# Altium schematic sheet arduino_uno.SchDoc
size 420 x 297 mm
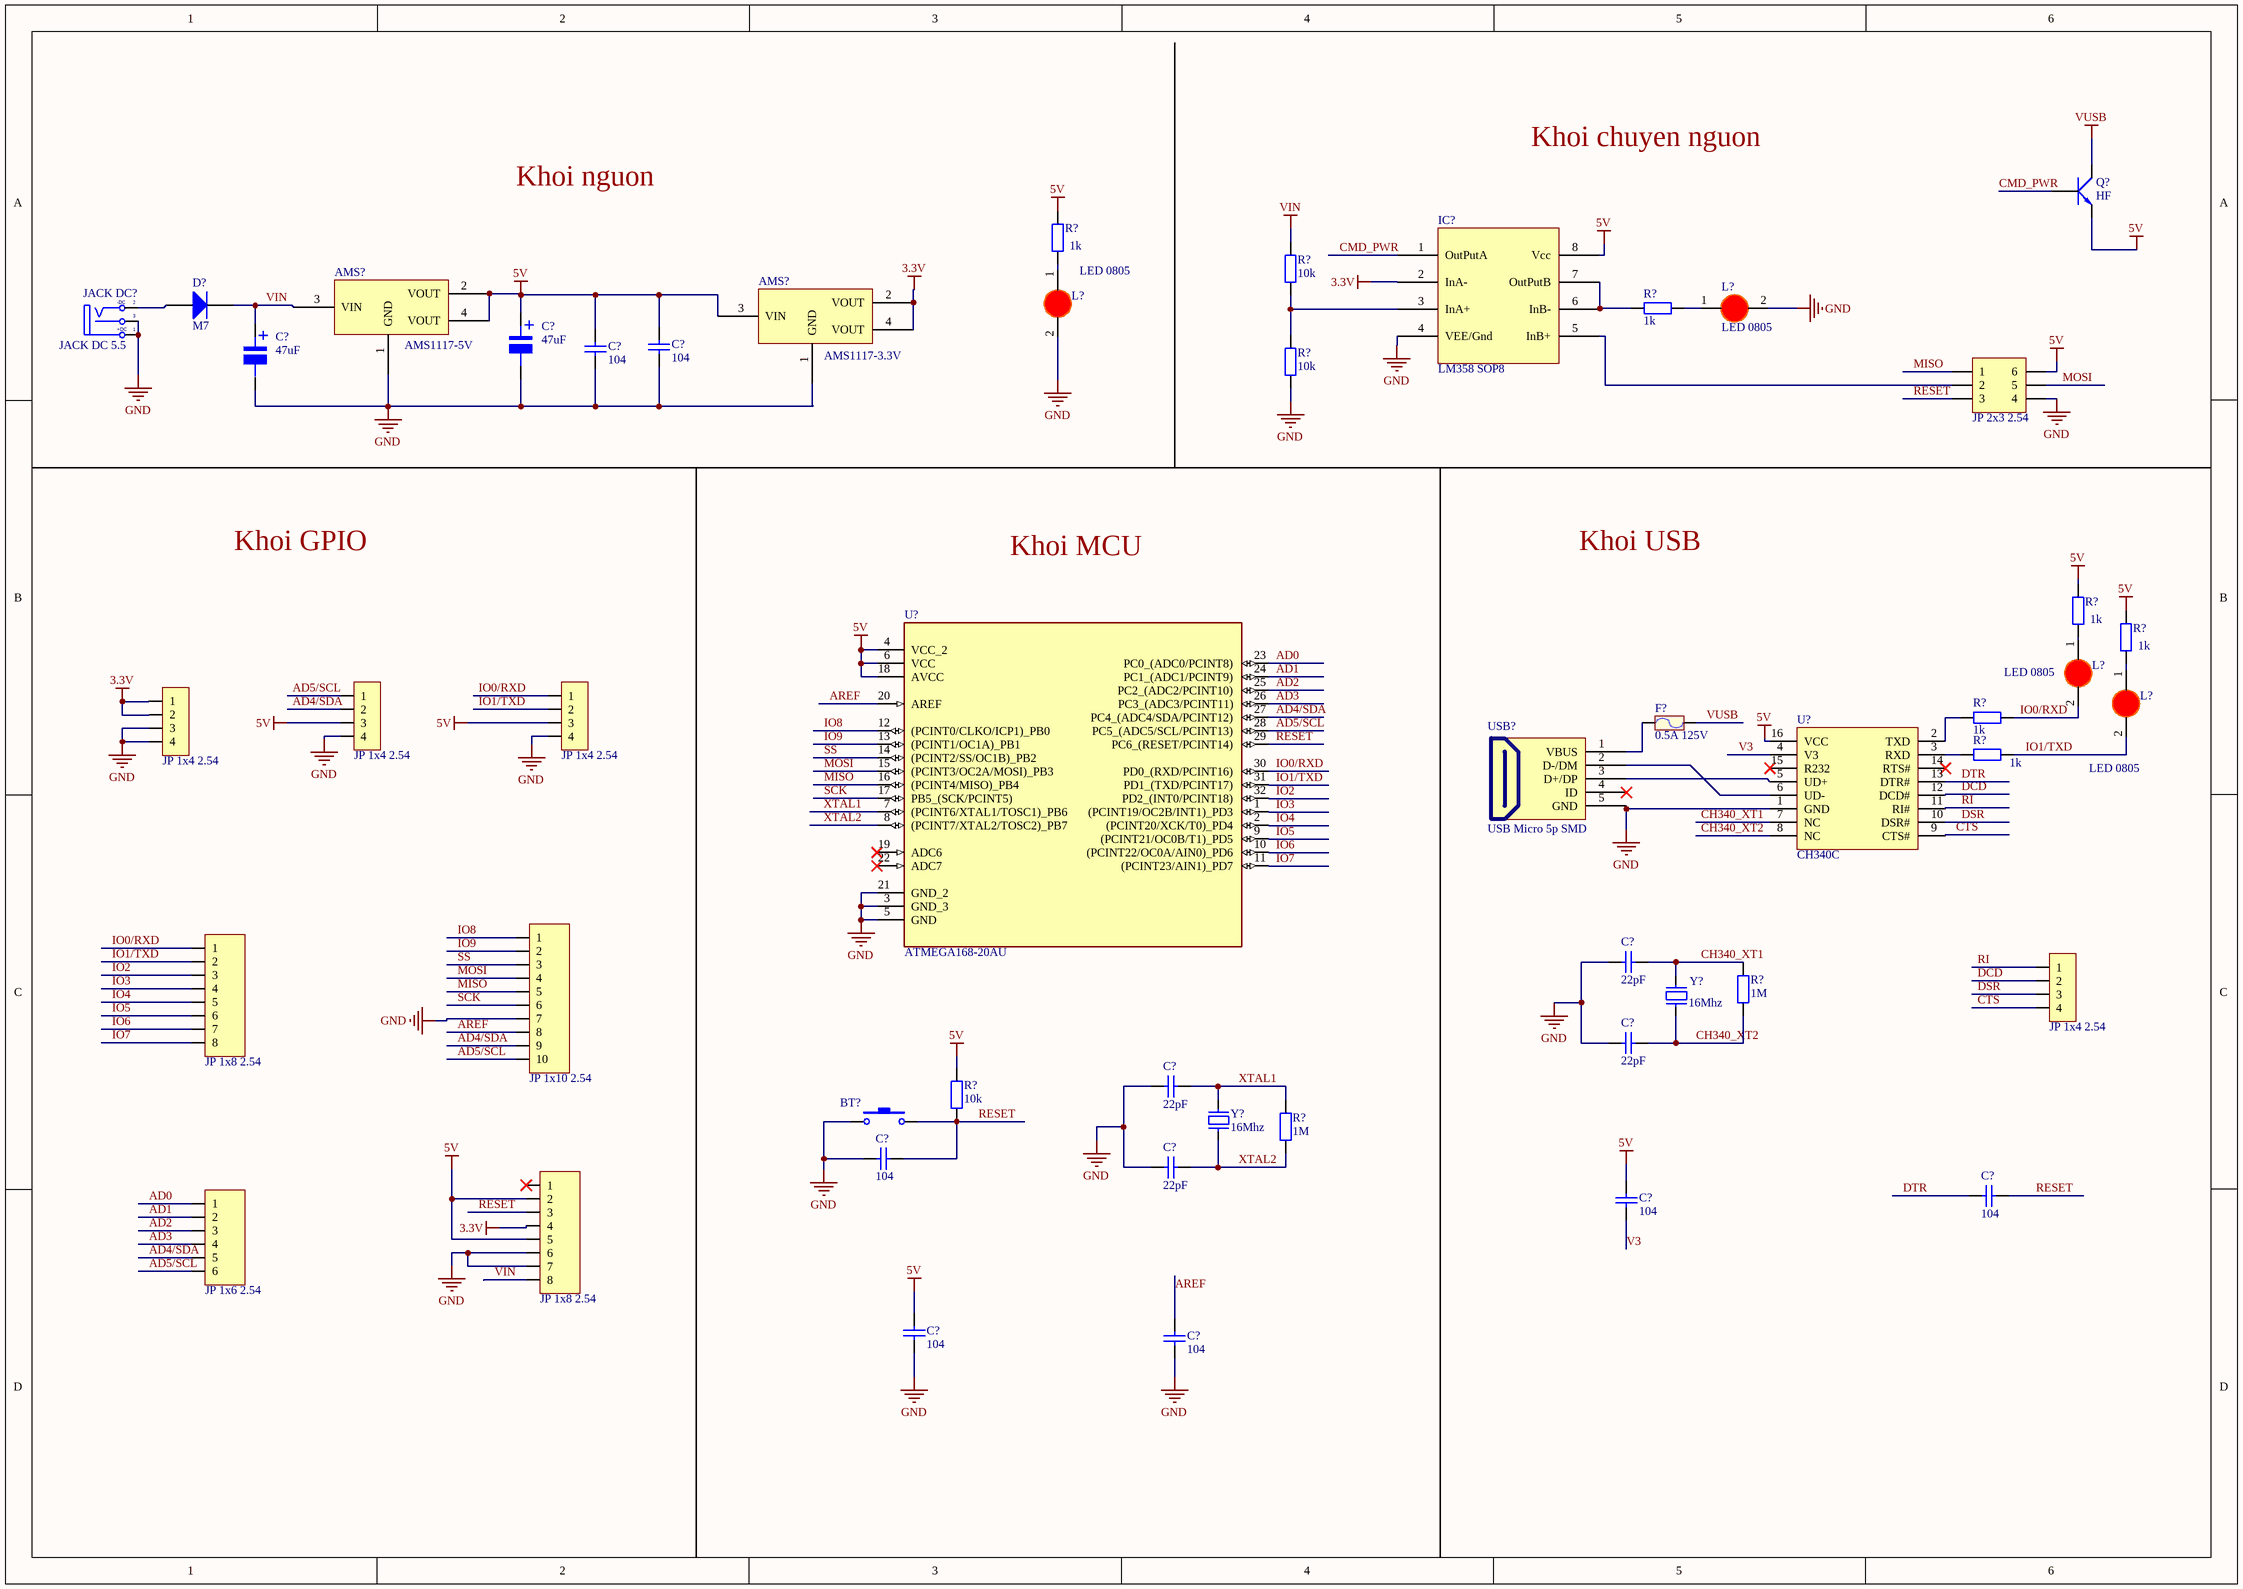
[diagram p0: arduino_uno.SchDoc]

## Parts
(Parts that share a designator on the sheet are numbered #1, #2 ... from top to bottom, then left to right.)
AMS?#1  AMS1117-5V  [SOT223]
AMS?#2  AMS1117-3.3V  [SOT223]
BT?  Nut Nhan 2 Chan SMD 3x6x2.5  [Nut Nhan 2 Chan SMD 3x6x2.5]  (value not drawn)
C?#1  47uF  [tu nhom 6.3 (d)]
C?#2  104  [tu 0805]
C?#3  104  [tu 0805]
C?#4  47uF  [tu nhom 6.3 (d)]
C?#5  22pF  [tu 0805]
C?#6  22pF  [tu 0805]
C?#7  22pF  [tu 0805]
C?#8  104  [tu 0805]
C?#9  22pF  [tu 0805]
C?#10  104  [tu 0805]
C?#11  104  [tu 0805]
C?#12  104  [tu 0805]
C?#13  104  [tu 0805]
D?  M7  [DIODE SMA]
F?  0.5A 125V  [Cau Chi SMD1808]
IC?  LM358 SOP8  [SOP 8]
JACK_DC?  JACK DC 5.5  [JACK DC 5.5]
JP?#1  JP 2x3 2.54  [JP 2x3 DT]
JP?#2  JP 1x4 2.54  [JP 1x4 DT]
JP?#3  JP 1x4 2.54  [JP 1x4 DT]
JP?#4  JP 1x4 2.54  [JP 1x4 DT]
JP?#5  JP 1x10 2.54  [JP 1x10 CT]
JP?#6  JP 1x8 2.54  [JP 1x8 CT]
JP?#7  JP 1x4 2.54  [JP 1x4 DT]
JP?#8  JP 1x8 2.54  [JP 1x8 CT]
JP?#9  JP 1x6 2.54  [JP 1x6 CT]
L?#1  LED 0805  [LED-0805-Red]
L?#2  LED 0805  [LED-0805-Red]
L?#3  LED 0805  [LED-0805-Red]
L?#4  LED 0805  [LED-0805-Red]
Q?  HF  [SOT23]
R?#1  1k  [tro smd 0805]
R?#2  10k  [tro smd 0805]
R?#3  1k  [tro smd 0805]
R?#4  10k  [tro smd 0805]
R?#5  1k  [tro smd 0805]
R?#6  1k  [tro smd 0805]
R?#7  1k  [tro smd 0805]
R?#8  1k  [tro smd 0805]
R?#9  1M  [tro smd 0805]
R?#10  10k  [tro smd 0805]
R?#11  1M  [tro smd 0805]
U?#1  CH340C  [SOIC16_50_284_25X90_SMT]
U?#2  ATMEGA168-20AU  [ATMEGA168]
USB?  USB Micro 5p SMD  [USB Micro 5p SMD]
Y?#1  16Mhz  [Thach Anh 2 chan SMD]
Y?#2  16Mhz  [Thach Anh 2 chan SMD]

## Nets
3.3V: AMS?#2.2(VOUT) AMS?#2.4(VOUT) IC?.2(InA-) JP?#4.1 JP?#4.2 JP?#8.4
5V: AMS?#1.2(VOUT) AMS?#1.4(VOUT) AMS?#2.3(VIN) C?#1.1 C?#2.2 C?#3.1 C?#10.1 C?#12.1 IC?.8(Vcc) JP?#1.6 JP?#2.3 JP?#3.3 JP?#8.2 JP?#8.5 Q?.2(E) R?#1.2 R?#5.2 R?#6.2 R?#10.2 U?#1.16(VCC) U?#2.4(VCC_2) U?#2.6(VCC) U?#2.18(AVCC)
GND: AMS?#1.1(GND) AMS?#2.1(GND) BT?.1 C?#1.2 C?#2.1 C?#3.2 C?#4.2 C?#5.2 C?#6.2 C?#7.1 C?#8.2 C?#9.2 C?#12.2 C?#13.2 IC?.4(VEE/Gnd) JACK_DC?.1(T) JACK_DC?.3(S) JP?#1.4 JP?#2.4 JP?#3.4 JP?#4.3 JP?#4.4 JP?#5.7 JP?#8.6 JP?#8.7 L?#1.2(K) L?#2.2(K) R?#4.1 U?#1.1(GND) U?#2.3(GND_3) U?#2.5(GND) U?#2.21(GND_2) USB?.5(GND)
VIN: AMS?#1.3(VIN) C?#4.1 D?.2(K) JP?#8.8 R?#2.2
VUSB: F?.2 Q?.3(C)
AD0: JP?#9.1 U?#2.23(PC0_(ADC0/PCINT8))
AD1: JP?#9.2 U?#2.24(PC1_(ADC1/PCINT9))
AD2: JP?#9.3 U?#2.25(PC2_(ADC2/PCINT10))
AD3: JP?#9.4 U?#2.26(PC3_(ADC3/PCINT11))
AD4/SDA: JP?#2.2 JP?#5.9 JP?#9.5 U?#2.27(PC4_(ADC4/SDA/PCINT12))
AD5/SCL: JP?#2.1 JP?#5.10 JP?#9.6 U?#2.28(PC5_(ADC5/SCL/PCINT13))
AREF: C?#13.1 JP?#5.8 U?#2.20(AREF)
CH340_XT1: C?#5.1 R?#9.2 U?#1.7(NC) Y?#1.2
CH340_XT2: C?#6.1 R?#9.1 U?#1.8(NC) Y?#1.1
CMD_PWR: IC?.1(OutPutA) Q?.1(B)
CTS: JP?#7.4 U?#1.9(CTS#)
DCD: JP?#7.2 U?#1.12(DCD#)
DSR: JP?#7.3 U?#1.10(DSR#)
DTR: C?#11.1 U?#1.13(DTR#)
IO0/RXD: JP?#3.1 JP?#6.1 L?#3.2(K) R?#7.2 U?#2.30(PD0_(RXD/PCINT16))
IO1/TXD: JP?#3.2 JP?#6.2 L?#4.2(K) R?#8.2 U?#2.31(PD1_(TXD/PCINT17))
IO2: JP?#6.3 U?#2.32(PD2_(INT0/PCINT18))
IO3: JP?#6.4 U?#2.1((PCINT19/OC2B/INT1)_PD3)
IO4: JP?#6.5 U?#2.2((PCINT20/XCK/T0)_PD4)
IO5: JP?#6.6 U?#2.9((PCINT21/OC0B/T1)_PD5)
IO6: JP?#6.7 U?#2.10((PCINT22/OC0A/AIN0)_PD6)
IO7: JP?#6.8 U?#2.11((PCINT23/AIN1)_PD7)
IO8: JP?#5.1 U?#2.12((PCINT0/CLKO/ICP1)_PB0)
IO9: JP?#5.2 U?#2.13((PCINT1/OC1A)_PB1)
MISO: JP?#1.1 JP?#5.5 U?#2.16((PCINT4/MISO)_PB4)
MOSI: JP?#1.5 JP?#5.4 U?#2.15((PCINT3/OC2A/MOSI)_PB3)
RESET: BT?.2 C?#8.1 C?#11.2 JP?#1.3 JP?#8.3 R?#10.1 U?#2.29(PC6_(RESET/PCINT14))
RI: JP?#7.1 U?#1.11(RI#)
SCK: JP?#5.6 U?#2.17(PB5_(SCK/PCINT5))
SS: JP?#5.3 U?#2.14((PCINT2/SS/OC1B)_PB2)
V3: C?#10.2 U?#1.4(V3)
XTAL1: C?#7.2 R?#11.1 U?#2.7((PCINT6/XTAL1/TOSC1)_PB6) Y?#2.2
XTAL2: C?#9.1 R?#11.2 U?#2.8((PCINT7/XTAL2/TOSC2)_PB7) Y?#2.1
NetD?_1: D?.1(A) JACK_DC?.2(TN)
NetF?_1: F?.1 USB?.1(VBUS)
NetIC?_3: IC?.3(InA+) R?#2.1 R?#4.2
NetIC?_5: IC?.5(InB+) JP?#1.2
NetIC?_6: IC?.6(InB-) IC?.7(OutPutB) R?#3.1
NetL?#1_1: L?#1.1(A) R?#1.1
NetL?#2_1: L?#2.1(A) R?#3.2
NetL?#3_1: L?#3.1(A) R?#5.1
NetL?#4_1: L?#4.1(A) R?#6.1
NetR?#7_1: R?#7.1 U?#1.2(TXD)
NetR?#8_1: R?#8.1 U?#1.3(RXD)
NetU?#1_5: U?#1.5(UD+) USB?.3(D+/DP)
NetU?#1_6: U?#1.6(UD-) USB?.2(D-/DM)

Not connected (* = marked no-connect by the designer): JP?#8 1*; U?#1 14(RTS#)* 15(R232)*; U?#2 19(ADC6)* 22(ADC7)*; USB? 4(ID)*

## Notes on the sheet
- Khoi nguon
- Khoi chuyen nguon
- Khoi GPIO
- Khoi MCU
- Khoi USB
- (in symbol JACK DC 5.5) -DC; +DC
- (in symbol Tu Nhom 47uF 50V) +

## Library data of the parts
AMS?#1 AMS?#2 = AMS1117 SMD: Dán; Value: AMS1117-3.3V SOT223; Don_Vi: Con; Ma_Hang: MH000596; Ghi_Chu: *; Kieu_Chan: *; Chung_Loai: Dán
BT? = Nut Nhan 2 Chan SMD 3x6x2.5: Ma_Hang: MH001036; Ten: Nút Nhấn 2 Chân 3x6x2.5MM SMD
C?#1 C?#4 = Tu Nhom 47uF 50V: Dán; Don_Vi: Con; So_Chan: 2; Ten_Linh_Kien: Tụ Nhôm 47uF 50V 6.3x5.5MM; Ma_Hang: MH002217; Chung_Loai: Dán; Kieu_Chan: *
C?#2 C?#3 C?#8 C?#10-C?#13 = Tu 0805 104 50V 10%: Dán; Don_Vi: Con; So_Chan: 2; Ten_Linh_Kien: Tụ 0805 104-100nF 10% 50V; Ma_Hang: MH004551; Chung_Loai: Dán; Kieu_Chan: *
C?#5-C?#7 C?#9 = Tu 0805 22pF 50V 10%: Dán; Don_Vi: Con; So_Chan: 2; Ten_Linh_Kien: Tụ 0805 22P 10% 50V; Ma_Hang: MH004560; Chung_Loai: Dán; Kieu_Chan: *
D? = Diode M7 ( 4007 ): Dán; Don_Vi: Con; Ten_Linh_Kien: Diode M7 1N4007 SMD 1A 1000V; Ma_Hang: MH000944; Chung_Loai: Dán; Ghi_Chu: *
F? = Cau chi 0.5A 125V SMD1808: Ma_Hang: MH009241; Ten: Cầu Chì 0.5A 125V SMD1808 0451.500MRL
IC? = LM358 SOP8: Dán; Ma_Hang: MH000609; Don_Vi: Con; Ten_Linh_Kien: LM358 SOP8; Kieu_Chan: *; Ghi_Chu: *; Chung_Loai: Dán
JACK_DC? = JACK DC 5.5: Value: Jac DC
JP?#1 = JP 2x3 2.54 Duc Thang: Cắm; Ten_Linh_Kien: Jump Đôi Đực 2.54MM 2x40P Thẳng 11MM; Don_Vi: Con; Ma_Hang: MH002686; Ghi_Chu: *; Kieu_Chan: *; Chung_Loai: Cắm
JP?#2-JP?#4 JP?#7 = JP 1x4 2.54 Duc Thang: Cắm; Ten_Linh_Kien: Jump Đơn Đực 2.54MM 1x40P Thẳng 11MM; Don_Vi: Con; Ma_Hang: MH000903; Ghi_Chu: *; Kieu_Chan: *; Chung_Loai: Cắm
JP?#5 = JP 1x10 2.54 Cai Thang: Cắm; Ten_Linh_Kien: Jump Đơn Cái 2.54MM 1x20P Thẳng; Don_Vi: Con; Ma_Hang: MH004006; Ghi_Chu: *; Kieu_Chan: *; Chung_Loai: Cắm
JP?#6 JP?#8 = JP 1x8 2.54 Cai Thang: Cắm; Ten_Linh_Kien: Jump Đơn Cái 2.54MM 1x20P Thẳng; Don_Vi: Con; Ma_Hang: MH004006; Ghi_Chu: *; Kieu_Chan: *; Chung_Loai: Cắm
JP?#9 = JP 1x6 2.54 Cai Thang: Cắm; Ten_Linh_Kien: Jump Đơn Cái 2.54MM 1x20P Thẳng; Don_Vi: Con; Ma_Hang: MH004006; Ghi_Chu: *; Kieu_Chan: *; Chung_Loai: Cắm
L?#1-L?#4 = LED 0805 Do: Dán; Don_Vi: Con; Ma_Hang: MH000897; Ten_Linh_Kien: LED 0805 Màu Đỏ (Red); Ghi_Chu: *; Kieu_Chan: *; Chung_Loai: Dán
Q? = C1815 HF SMD: NPN transistor; Value: C9014
R?#1 R?#5-R?#8 = Tro 0805 1% 1k: Dán; Don_Vi: Con; So_Chan: 2; Ten_Linh_Kien: Trở 0805 1% 1k; Ma_Hang: MH005468; Chung_Loai: Dán; Kieu_Chan: *
R?#2 R?#4 R?#10 = Tro 0805 5% 10k: Dán; Don_Vi: Con; So_Chan: 2; Ten_Linh_Kien: Trở 0805 5% 10k; Ma_Hang: MH005239; Chung_Loai: Dán; Kieu_Chan: *
R?#3 = Tro 0805 5% 1k: Dán; Don_Vi: Con; So_Chan: 2; Ten_Linh_Kien: Trở 0805 5% 1k; Ma_Hang: MH005234; Chung_Loai: Dán; Kieu_Chan: *
R?#9 R?#11 = Tro 0805 5% 1M: Dán; Don_Vi: Con; So_Chan: 2; Ten_Linh_Kien: Trở 0805 5% 1M; Ma_Hang: MH005235; Chung_Loai: Dán; Kieu_Chan: *
U?#1 = IC_CH340C: USB Bridge, USB to UART USB 2.0 UART Interface; Manufacturer: Olimex; Alternate Part Number-1: NA; Manufacturer Part Number: CH340C; Case/Package: SOIC16; Supplier-1: LCSC; Supplier Part Number-1: C84681
U?#2 = ATMEGA168-20AU: AVR AVRÂ® ATmega Microcontroller IC 8-Bit 20MHz 16KB _8K x 16_ FLASH 32-TQFP _7x7_; MF: Microchip; MP: ATMEGA168-20AU; Availability: Unavailable; Package: TQFP-32 Microchip; Price: None; SnapEDA_Link: https://www.snapeda.com/parts/ATMEGA168-20AU/Microchip/view-part/776709/?ref=snap; Value: *
USB? = USB Micro 5p SMD: USB Type B; Ten: MicroUSB MK5P SMD; Ma_Hang: MH001020
Y?#1 Y?#2 = Thach Anh 2 chan SMD: Crystal For all Crystal 2pin.; Value: 4Mhz